# EAGLE design Ablatometer Keller 7LD (EAGLE 9.6.2)
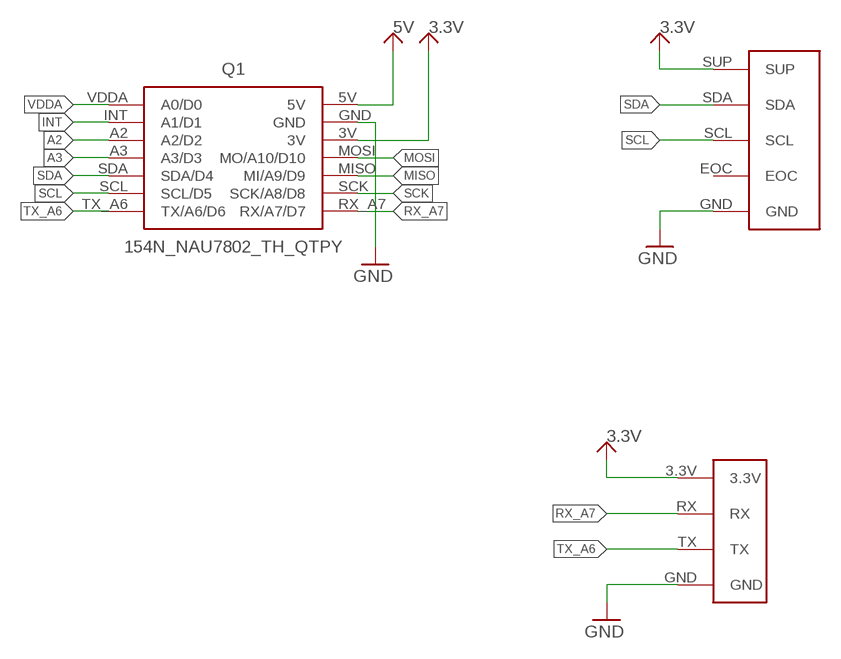
[diagram p0: schematic, sheet 1]

## Parts
Q1  154N_NAU7802_TH_QTPY  [154N_NAU7802_TH_QTPY]
U$1  KELLER_7LD  [KELLER_7LD]
U$3  WIRE_PADS  [WIRE_PADS]

## Nets
3.3V [3.3V]: Q1.3V U$1.SUP U$3.3.3V
5V [power]: Q1.5V ; supply symbol labelled 3.3V
A2: Q1.A2(A2/D2)
A3: Q1.A3(A3/D3)
GND: Q1.GND U$1.GND U$3.GND
INT: Q1.INT(A1/D1)
MISO: Q1.MISO(MI/A9/D9)
MOSI: Q1.MOSI(MO/A10/D10)
RX_A7: Q1.RX_A7(RX/A7/D7) U$3.RX
SCK: Q1.SCK(SCK/A8/D8)
SCL: Q1.SCL(SCL/D5) U$1.SCL
SDA: Q1.SDA(SDA/D4) U$1.SDA
TX_A6: Q1.TX_A6(TX/A6/D6) U$3.TX
VDDA: Q1.VDDA(A0/D0)
Unconnected: U$1.EOC

## Library data of the parts
Q1 = Ablatometer Keller 7LD:154N_NAU7802_TH_QTPY
U$1 = UIO-John:KELLER_7LD
U$3 = UIO-John:WIRE_PADS

## Net classes
1 power: width 0.254 mm
2 3.3V: width 0.406 mm

## Board
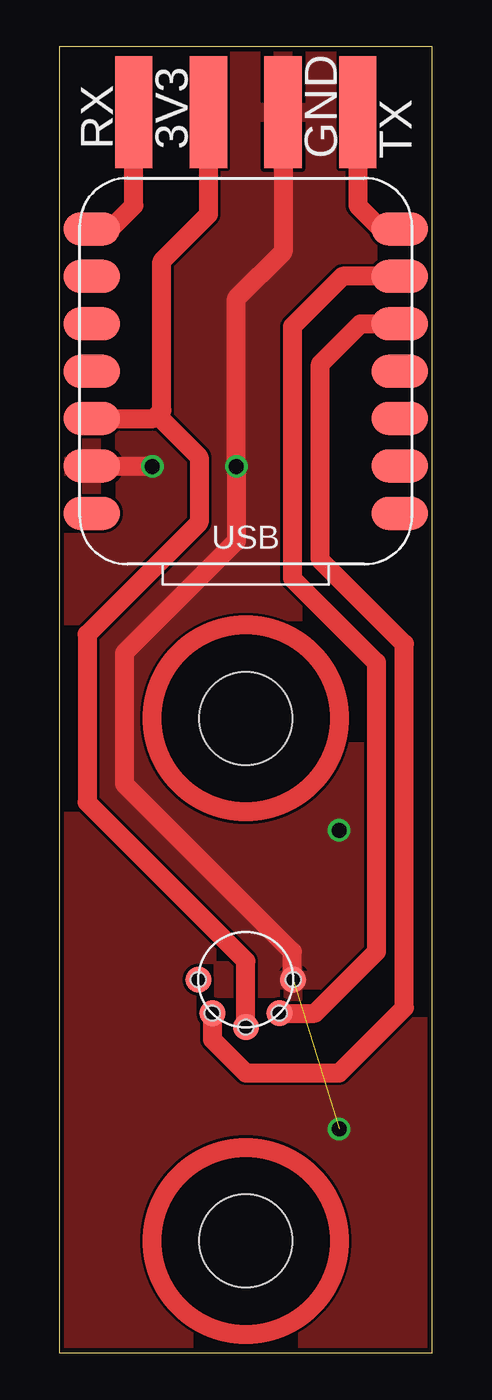
[diagram p1: board, top side]
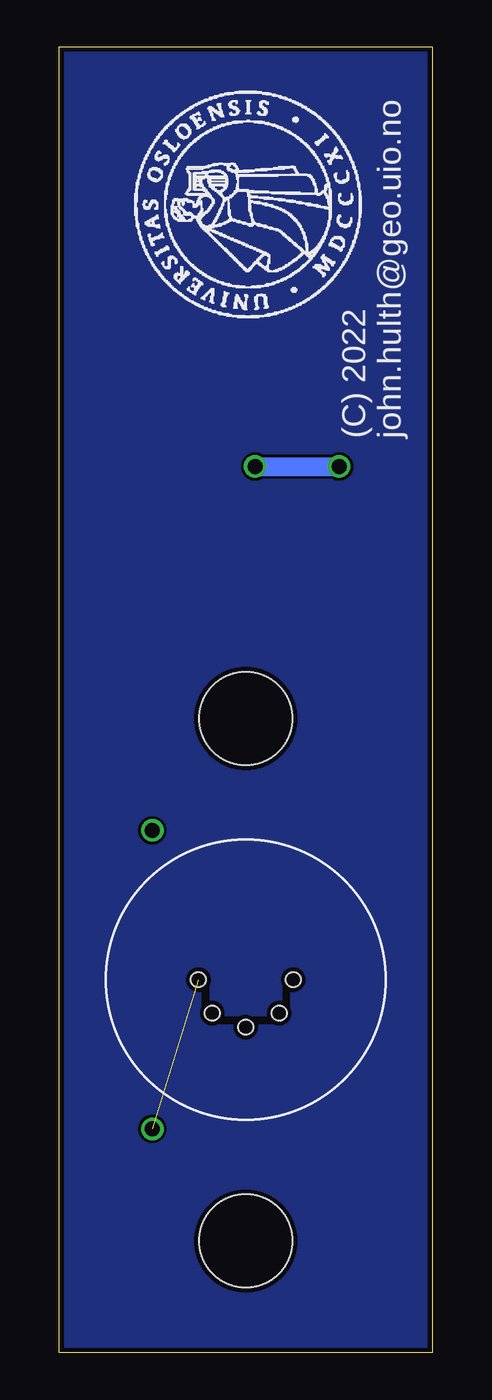
[diagram p2: board, bottom side, seen from below]

Size 20 x 70 mm. Coordinates in mm from the lower left corner, seen from the top.
Outline: 20,70 0,70 0,0 20,0 20,70
Copper layers (1*16): Top 0.018mm / dielectric 1.55mm / Bottom 0.018mm
Design rules "eC_2Layer_PClass6_BaseCopperO18_eCDefault": minimum track width 0.15mm, minimum drill 0.35mm, track to track 0.15mm, track to pad 0.15mm, pad to pad 0.15mm, via to via 0.15mm, smd to smd 0mil, copper to edge 0.25mm, drill to drill 0.35mm, minimum pad ring 0.175mm, minimum via ring 0.125mm, stop-mask expansion 0mil, vias tented up to drill 0.45mm, thermal gap 0.2mm
Holes 5 mm at 10,34 10,6

### Footprints (pad centres in the part's own frame; a part is rotated, then mirrored left to right if it is on the bottom)
154N_NAU7802_TH_QTPY = smd 3.048 x 1.778: 3V 8.255,2.54; 5V 8.255,7.62; A2 -8.255,2.54; A3 -8.255,0; GND 8.255,5.08; INT -8.255,5.08; MISO 8.255,-2.54; MOSI 8.255,0; RX_A7 8.255,-7.62; SCK 8.255,-5.08; SCL -8.255,-5.08; SDA -8.255,-2.54; TX_A6 -8.255,-7.62; VDDA -8.255,7.62
KELLER_7LD = smd 1.397 x 1.397: EOC -2.54,0; GND 2.54,0; SCL 1.795,-1.795; SDA -1.795,-1.795; SUP 0,-2.54 | hole 0.8: -2.54,0; -1.795,-1.795; 0,-2.54; 1.795,-1.795; 2.54,0
WIRE_PADS = smd 2 x 6: 3.3V -2,0; GND 2,0; RX -6,0; TX 6,0

### Placement (x,y rotation side)
Q1  10,52.61 180 top
U$1  10,20 0 top
U$3  10,66.5 0 top
U$6  [UIO-LOGO-BL]  3.54,55.22 90 bottom

### Tracks (layer width: path | path; a pad name or v marks a point on that pad's centre or on a via)
3.3V
  Top 1.016: U$1.SUP 10,21 1.5,29.5 1.5,38.5 7.5,44.5 7.5,48 5.25,50.25 | U$3.3.3V 8,61 5.5,58.5 5.5,50.5 5.25,50.25 | Q1.3V 5.07,50.07 5.25,50.25
GND  (via drill 0.8)  (1 unrouted)
  Top 1.016: U$1.GND 12.5,20.04 12.5,21.5 3.5,30.5 3.5,37.5 9.5,43.5 v9.5,47.5 9.5,56.5 12,59 U$3.GND | v5,47.5 4.97,47.53 Q1.GND
  Bottom 1.016: v9.5,47.5 v5,47.5
  other vias: 15,28 15,12
  pour Top: 0,71.5 0,0 20,0 20,71.5
GND2
  pour Bottom: 0,0 20,0 20,70.5 0,70.5
RX_A7
  Top 1.016: Q1.RX_A7 2.75,60.23 4,61.48 U$3.RX
SCL
  Top 1.016: Q1.SCL 15.19,57.69 12.5,55 12.5,41.5 17,37 17,21.5 13.71,18.2 U$1.SCL
SDA
  Top 1.016: U$1.SDA 8.21,16.8 10,15 15,15 18.5,18.5 18.5,38 14,42.5 14,53 16.15,55.15 Q1.SDA
TX_A6
  Top 1.016: Q1.TX_A6 17.25,60.23 16,61.48 U$3.TX
(copper drawn outside any net)
  shapes: Top circle x2

### Text on the board
tPlace: RX | 3V3 | GND | TX
bPlace: (C) 2022 / john.hulth@geo.uio.no